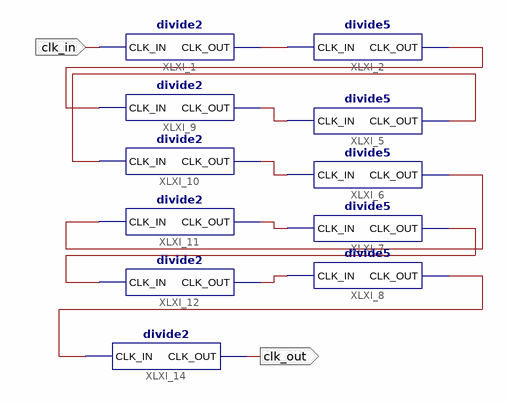
[diagram p0: schematic sheet 1]
// Xilinx ISE schematic divideTo100Hz.sch (spartan6) as structural Verilog: 11 symbols, 2 ports
module divideTo100Hz (
  input  clk_in,
  output clk_out
);

  wire XLXN_1, XLXN_3, XLXN_5, XLXN_9, XLXN_11, XLXN_15, XLXN_16, XLXN_17, XLXN_18, XLXN_19;

  divide2 XLXI_1 (.CLK_IN(clk_in), .CLK_OUT(XLXN_1));
  divide5 XLXI_2 (.CLK_IN(XLXN_1), .CLK_OUT(XLXN_15));
  divide5 XLXI_5 (.CLK_IN(XLXN_3), .CLK_OUT(XLXN_16));
  divide5 XLXI_6 (.CLK_IN(XLXN_5), .CLK_OUT(XLXN_17));
  divide5 XLXI_7 (.CLK_IN(XLXN_9), .CLK_OUT(XLXN_18));
  divide5 XLXI_8 (.CLK_IN(XLXN_11), .CLK_OUT(XLXN_19));
  divide2 XLXI_9 (.CLK_IN(XLXN_15), .CLK_OUT(XLXN_3));
  divide2 XLXI_10 (.CLK_IN(XLXN_16), .CLK_OUT(XLXN_5));
  divide2 XLXI_11 (.CLK_IN(XLXN_17), .CLK_OUT(XLXN_9));
  divide2 XLXI_12 (.CLK_IN(XLXN_18), .CLK_OUT(XLXN_11));
  divide2 XLXI_14 (.CLK_IN(XLXN_19), .CLK_OUT(clk_out));
endmodule
